# EAGLE design H Bridge (EAGLE 7.7.0)
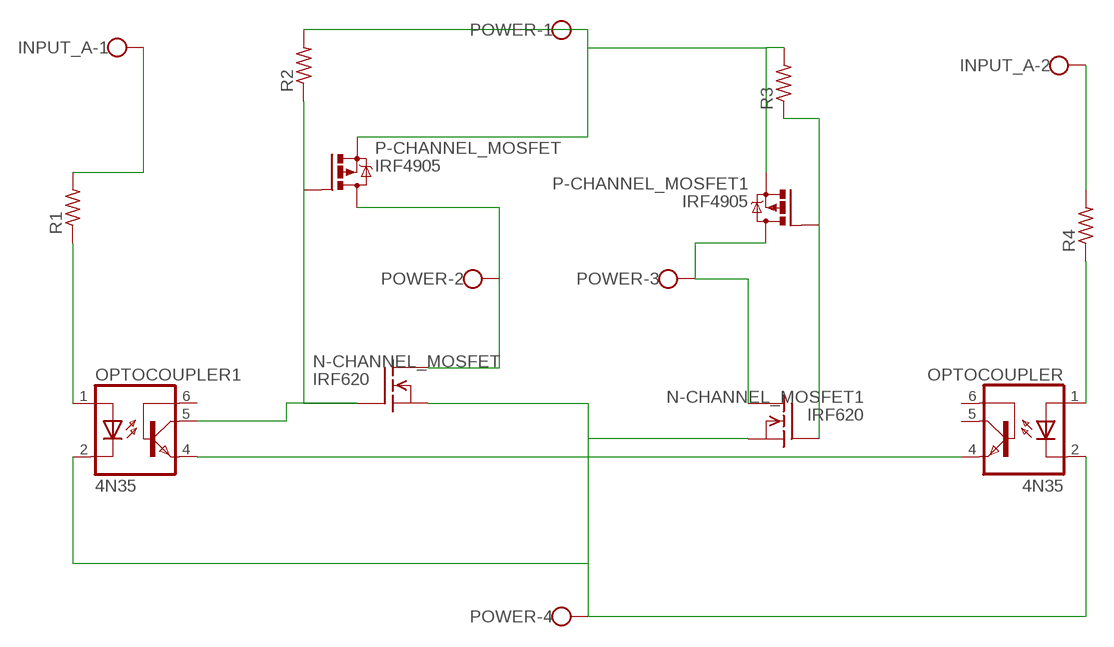
[diagram p0: schematic, sheet 1]

## Parts
INPUT_A  W237-4  [W237-4]
N-CHANNEL_MOSFET  IRF620  [TO220]
N-CHANNEL_MOSFET1  IRF620  [TO220]
OPTOCOUPLER  4N35  [DIL06]
OPTOCOUPLER1  4N35  [DIL06]
P-CHANNEL_MOSFET  IRF4905  [TO220BH]
P-CHANNEL_MOSFET1  IRF4905  [TO220BH]
POWER  W237-4  [W237-4]
R1  R-US_0207/10  [0207/10]
R2  R-US_0207/10  [0207/10]
R3  R-US_0207/10  [0207/10]
R4  R-US_0207/10  [0207/10]

## Nets
N$1: P-CHANNEL_MOSFET1.S P-CHANNEL_MOSFET.S POWER.1 R2.2 R3.2
N$2: N-CHANNEL_MOSFET.1(G) OPTOCOUPLER1.5(COL) P-CHANNEL_MOSFET.G R2.1
N$3: N-CHANNEL_MOSFET1.3(S) N-CHANNEL_MOSFET.3(S) OPTOCOUPLER1.2(C) OPTOCOUPLER1.4(EMI) OPTOCOUPLER.2(C) OPTOCOUPLER.4(EMI) POWER.4
N$4: N-CHANNEL_MOSFET1.1(G) P-CHANNEL_MOSFET1.G R3.1
N$5: N-CHANNEL_MOSFET1.2(D) P-CHANNEL_MOSFET1.D POWER.3
N$6: N-CHANNEL_MOSFET.2(D) P-CHANNEL_MOSFET.D POWER.2
N$7: OPTOCOUPLER1.1(A) R1.1
N$8: INPUT_A.1 R1.2
N$9: INPUT_A.2 R4.2
N$10: OPTOCOUPLER.1(A) R4.1
Unconnected: INPUT_A.3 INPUT_A.4 OPTOCOUPLER1.6(BAS) OPTOCOUPLER.5(COL) OPTOCOUPLER.6(BAS)

## Library data of the parts
INPUT_A POWER = con-wago-500:W237-4: WAGO SCREW CLAMP; OC_FARNELL: unknown; OC_NEWARK: unknown
N-CHANNEL_MOSFET N-CHANNEL_MOSFET1 = transistor-fet:IRF620: N-Channel Enhancement MOSFET (HEXFET); 200V; 5,2A; 0,8Ohm
OPTOCOUPLER OPTOCOUPLER1 = optocoupler:4N35: MOTOROLA OPTO COUPLER; MF: FAIRCHILD SEMICONDUCTOR; MPN: 4N35; OC_FARNELL: 1328375; OC_NEWARK: 72K9946
P-CHANNEL_MOSFET P-CHANNEL_MOSFET1 = transistor-power:IRF4905: P-Channel HEXFET® Power MOSFET RDS(on)= 0.02 Ohm, ID = -74A Source: http://www.irf.com/product-info/datasheets/data/irf4905pbf.pdf
R1-R4 = resistor:R-US_: RESISTOR, American symbol

## Net classes
0 default: width 0.762 mm, drill 1 mm, clearance 0.205 mm

## Board
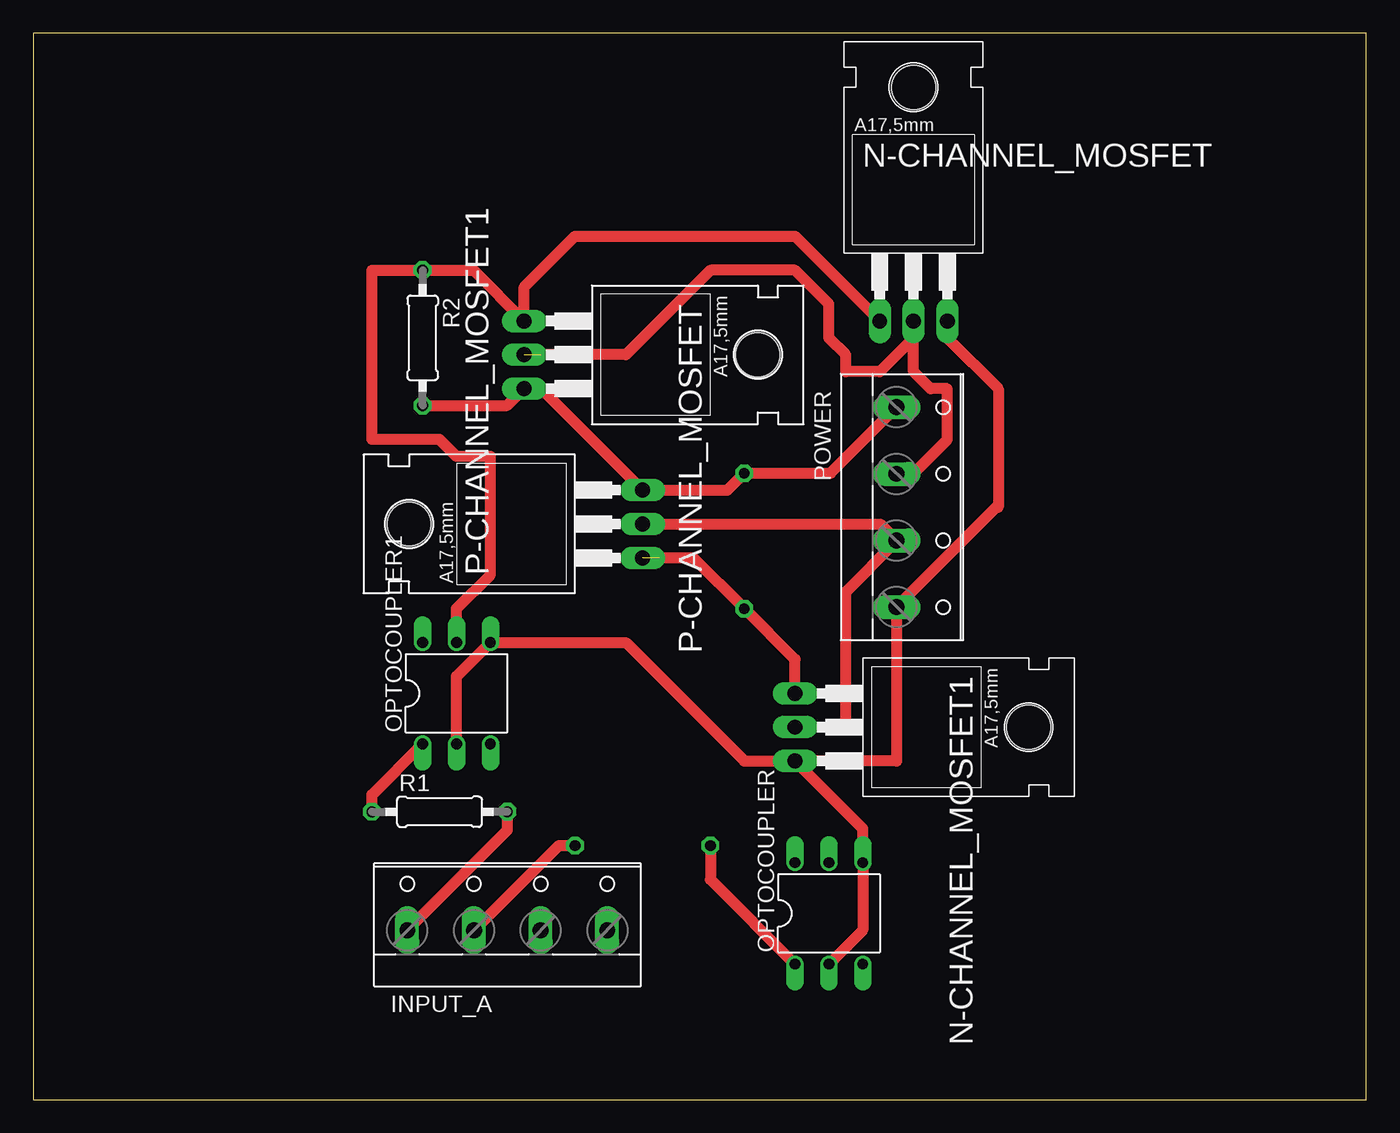
[diagram p1: board, top side]
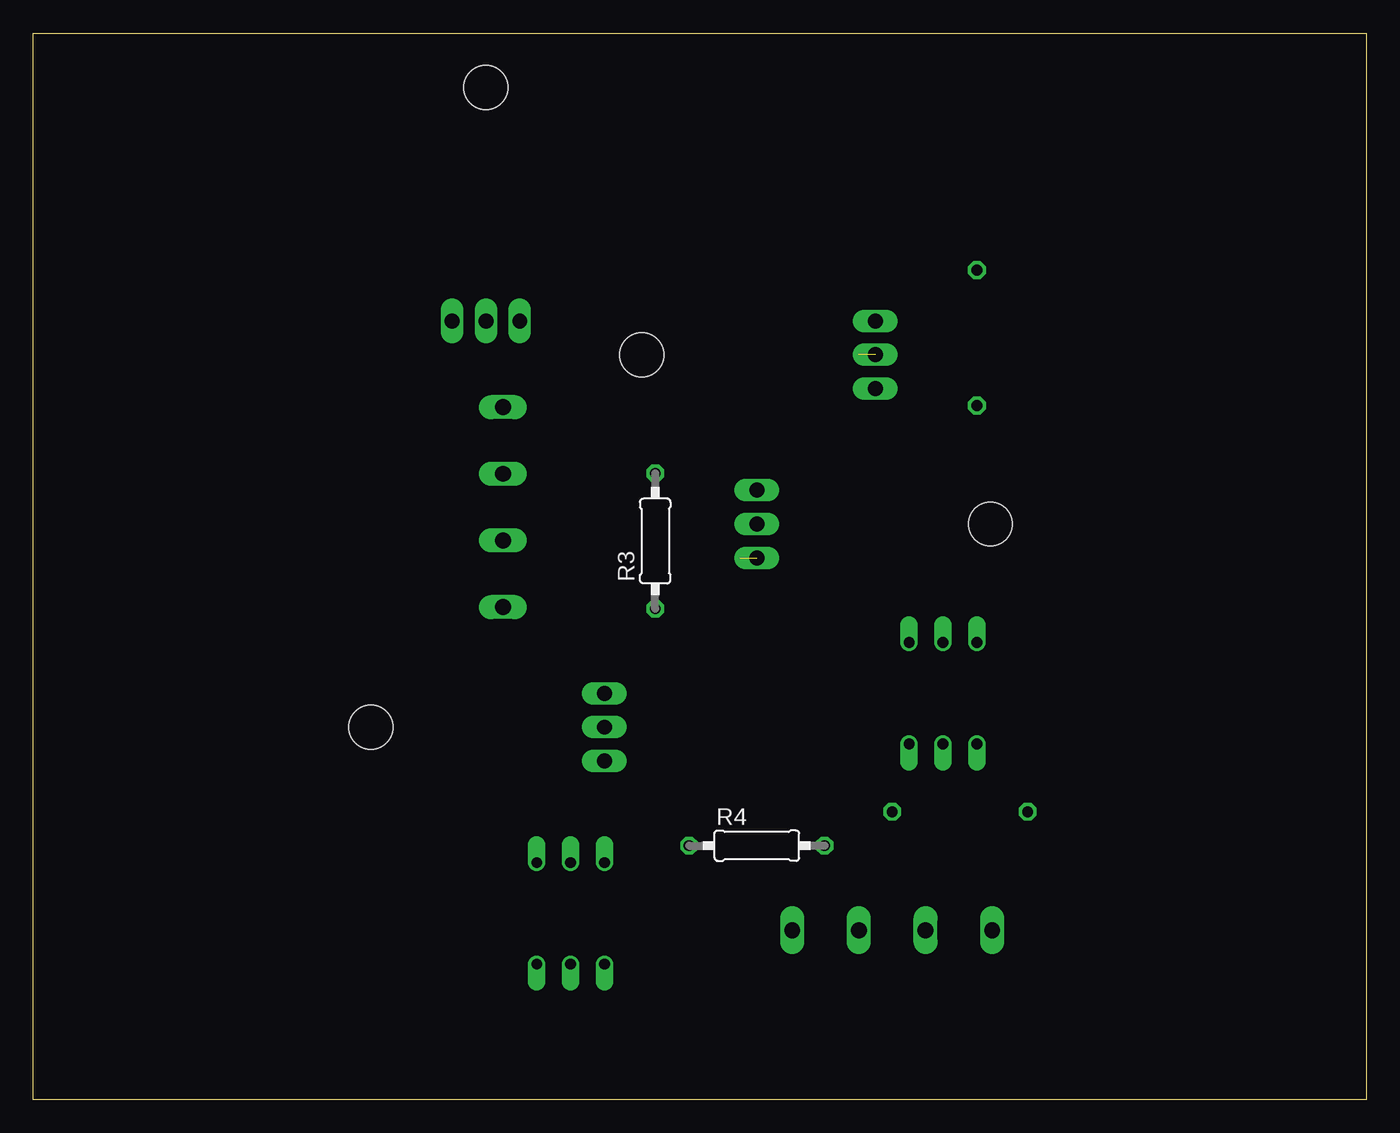
[diagram p2: board, bottom side, seen from below]

Size 100 x 80 mm. Coordinates in mm from the lower left corner, seen from the top.
Outline: 0,0 100,0 100,80 0,80 0,0
Copper layers (1*16): Top 0.035mm / dielectric 1.5mm / Bottom 0.035mm
Design rules "H Bridge": minimum track width 10mil, minimum drill 24mil, track to track 0.205mm, track to pad 0.205mm, pad to pad 0.205mm, via to via 0.205mm, smd to smd 8mil, copper to edge 40mil, drill to drill 8mil, minimum pad ring 10mil, minimum via ring 8mil, stop-mask expansion 4mil, vias tented up to drill 0mil, thermal gap 10mil

### Footprints (pad centres in the part's own frame; a part is rotated, then mirrored left to right if it is on the bottom)
W237-4 = drill 1.194 long: 1 -7.5,-1.27; 2 -2.5,-1.27; 3 2.5,-1.27; 4 7.5,-1.27
TO220 = drill 1.118 long: 1 -2.54,-6.35; 2 0,-6.35; 3 2.54,-6.35 | hole 3.302: 0,11.176
DIL06 = drill 0.813 offset: 1 -2.54,-3.81; 2 0,-3.81; 3 2.54,-3.81; 4 2.54,3.81; 5 0,3.81; 6 -2.54,3.81
TO220BH = drill 1.118 long: D 0,-6.35; G -2.54,-6.35; S 2.54,-6.35 | hole 3.302: 0,11.176
0207/10 = drill 0.813 octagon: 1 -5.08,0; 2 5.08,0

### Placement (x,y rotation side)
INPUT_A  35.56,13.97 0 top
N-CHANNEL_MOSFET  66.04,64.77 0 top
N-CHANNEL_MOSFET1  63.5,27.94 270 top
OPTOCOUPLER  59.69,13.97 0 top
OPTOCOUPLER1  31.75,30.48 0 top
P-CHANNEL_MOSFET  43.18,55.88 270 top
P-CHANNEL_MOSFET1  39.37,43.18 90 top
POWER  66.04,44.45 270 top
R1  30.48,21.59 0 top
R2  29.21,57.15 270 top
R3  53.34,41.91 90 bottom
R4  45.72,19.05 0 bottom

### Tracks (layer width: path | path; a pad name or v marks a point on that pad's centre or on a via)
N$1
  Top 0.813: R2.2 35.56,52.07 P-CHANNEL_MOSFET.S 38.1,53.34 P-CHANNEL_MOSFET1.S 52.07,45.72 R3.2 59.81,46.99 POWER.1
N$2
  Top 0.813: OPTOCOUPLER1.5 31.75,36.83 34.29,39.37 34.29,48.26 31.75,48.26 30.48,49.53 25.4,49.53 25.4,62.23 R2.1 33.02,62.23 P-CHANNEL_MOSFET.G 36.83,60.96 40.64,64.77 57.15,64.77 N-CHANNEL_MOSFET.1
N$3
  Top 0.813: OPTOCOUPLER.2 62.23,12.7 OPTOCOUPLER.4 62.23,20.32 57.78,24.77 | 57.78,24.77 N-CHANNEL_MOSFET1.3 53.34,25.4 44.45,34.29 OPTOCOUPLER1.4 31.75,31.75 OPTOCOUPLER1.2 | 57.78,24.77 58.42,25.4 64.77,25.4 POWER.4 72.27,44.45 72.39,44.45 72.39,53.34 68.58,57.15 N-CHANNEL_MOSFET.3
N$4  (1 unrouted)
  Top 0.813: N-CHANNEL_MOSFET1.1 57.15,33.02 R3.1 49.53,40.64 46.99,40.64
N$5
  Top 0.813: N-CHANNEL_MOSFET1.2 60.96,27.94 60.96,38.1 64.77,41.91 POWER.3 63.54,43.18 P-CHANNEL_MOSFET1.D
N$6  (1 unrouted)
  Top 0.813: POWER.2 66,46.95 68.58,49.53 68.58,53.34 67.31,53.34 66.04,54.61 N-CHANNEL_MOSFET.2 66.04,57.15 63.5,54.61 60.96,54.61 60.96,55.88 59.69,57.15 59.69,59.69 57.15,62.23 50.8,62.23 44.45,55.88 38.1,55.88
N$7
  Top 0.813: R1.1 25.4,22.86 OPTOCOUPLER1.1
N$8
  Top 0.813: R1.2 35.56,20.2 INPUT_A.1
N$9
  Top 0.813: R4.2 39.41,19.05 INPUT_A.2
N$10
  Top 0.813: R4.1 50.8,16.51 OPTOCOUPLER.1